# Altium schematic sheet 13-Experimental.SchDoc
size B; SheetNumber: 13; SheetTotal: 22
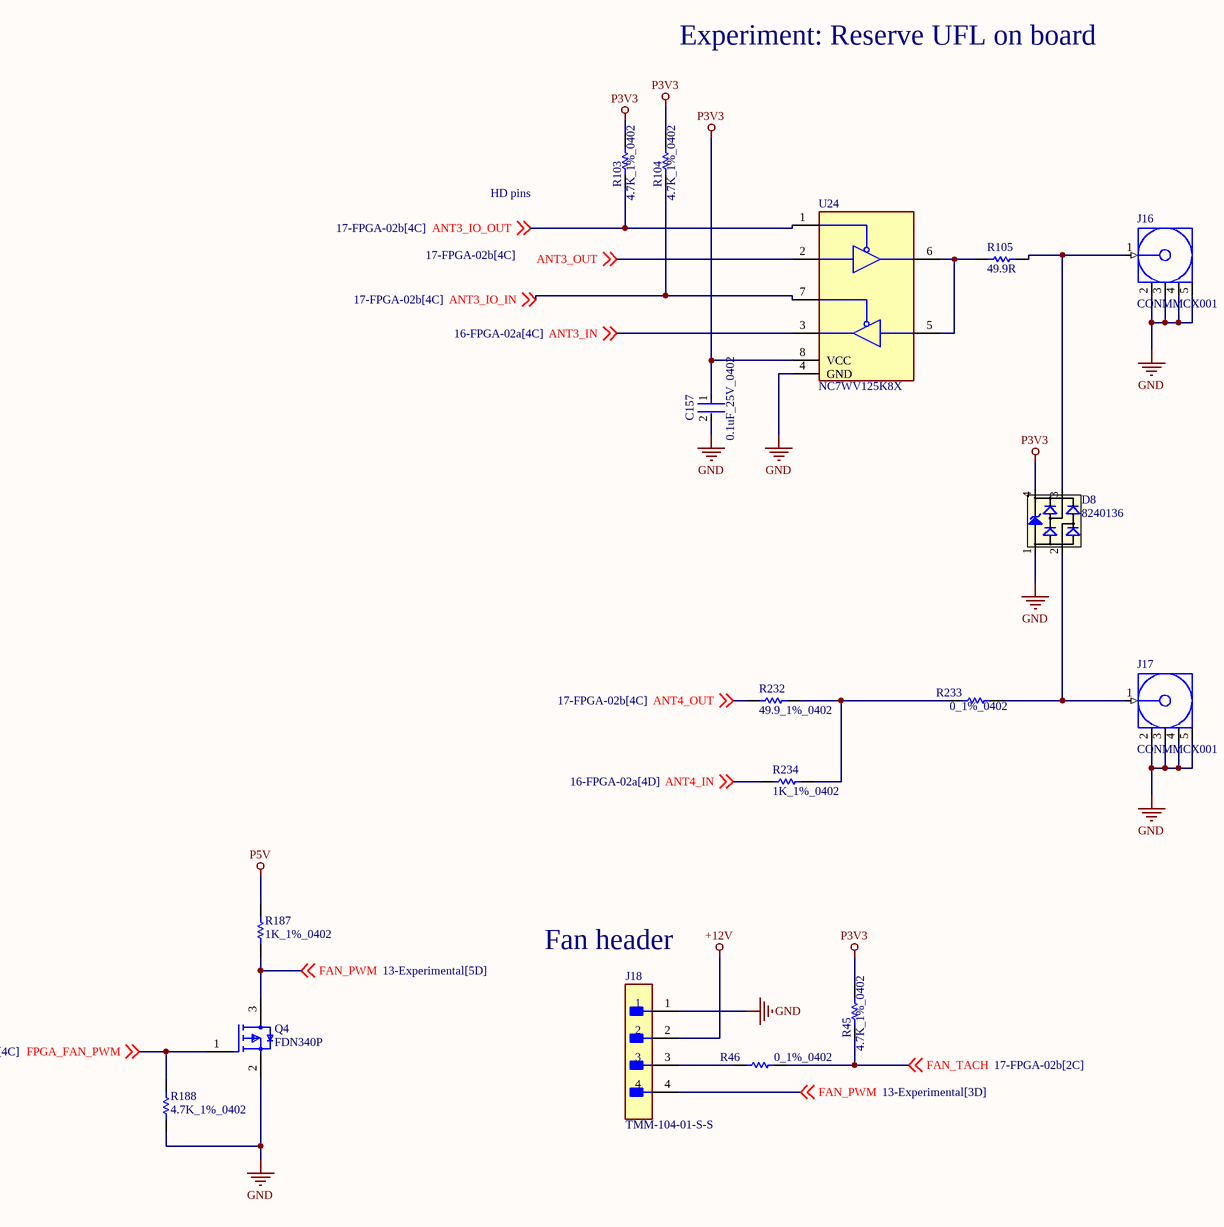
[diagram p0: 13-Experimental.SchDoc]

## Parts
C157  0.1uF_25V_0402  [FP-0402-L_1_0_1-W_0_5_0_1-IPC_C]
D8  8240136  [SOT143-4L]
J16  CONMMCX001  [CON-MMCX]
J17  CONMMCX001  [CON-MMCX]
J18  TMM-104-01-S-S  [FP-TMM-104-01-S-S-MFG]
Q4  FDN340P  [FP-527AG-MFG]
R45  4.7K_1%_0402  [RESC1005X40X25NL10T10]
R46  0_1%_0402  [RESC1005X40X25LL05T05]
R103  4.7K_1%_0402  [RESC1005X40X25NL10T10]
R104  4.7K_1%_0402  [RESC1005X40X25NL10T10]
R105  49.9R  [RESC1608X55X25NL10T15]
R187  1K_1%_0402  [RESC1005X40X25NL05T05]
R188  4.7K_1%_0402  [RESC1005X40X25NL10T10]
R232  49.9_1%_0402  [RESC1005X40X25NL10T10]
R233  0_1%_0402  [RESC1005X40X25LL05T05]
R234  1K_1%_0402  [RESC1005X40X25NL05T05]
U24  NC7WV125K8X  [SOP50P310X90-8N]

## Nets
+12V: J18.2
GND: C157.2 D8.1(GND) J16.2(GND) J16.3(GND) J16.4(GND) J16.5(GND) J17.2(GND) J17.3(GND) J17.4(GND) J17.5(GND) J18.1 Q4.2(S) R188.1 U24.4(GND)
P3V3: C157.1 D8.4(VDD) R45.1 R103.1 R104.1 U24.8(VCC)
P5V: R187.2
ANT3_IN: U24.3 ; off-sheet ANT3_IN
ANT3_IO_IN: R104.2 U24.7 ; off-sheet ANT3_IO_IN
ANT3_IO_OUT: R103.2 U24.1 ; off-sheet ANT3_IO_OUT
ANT3_OUT: U24.2 ; off-sheet ANT3_OUT
ANT4_IN: R234.1 ; off-sheet ANT4_IN
ANT4_OUT: R232.1 ; off-sheet ANT4_OUT
FAN_PWM: J18.4 Q4.3(D) R187.1 ; off-sheet FAN_PWM
FAN_TACH: R45.2 R46.2 ; off-sheet FAN_TACH
FPGA_FAN_PWM: Q4.1(G) R188.2 ; off-sheet FPGA_FAN_PWM
NetD8_2: D8.2(I/O1) J17.1(Signal) R233.2
NetD8_3: D8.3(I/O2) J16.1(Signal) R105.2
NetJ18_3: J18.3 R46.1
NetR105_1: R105.1 U24.5 U24.6
NetR232_2: R232.2 R233.1 R234.2

## Notes on the sheet
- Experiment: Reserve UFL on board
- HD pins
- Fan header

## Library data of the parts
C157 = CMP-2008-02519-2: General Purpose Ceramic Capacitor, 0402, 100nF, 10%, X7R, 15%, 25V; Package Quantity: 1; Capacitance: 100nF; Min Operating Temperature: -55°C; Voltage: 25V; Voltage Rating: 25V; Construction: Flat; Max Operating Temperature: 125°C; Radiation Hardening: No; Depth: 0.5mm; Thickness: 0.022inch; Voltage Rating (DC): 25V; Number of Pins: 2; Lead Free: Lead Free; Series: -; REACH SVHC: No SVHC; Length: 1mm; Dielectric: X7R; RoHS Compliant: Yes; Mount: Surface Mount; Packaging: Tape and Reel; Case/Package: 0402; Case Code (Imperial): 0402; Termination: SMD/SMT; Width: 0.02inch; Case Code (Metric): 1005; Tolerance: 10%
D8 = CMP-1486-00002-1: TVS Diode WE-TVS-HS, VRWM=3.3V; Manufacturer: Wuerth Elektronik; Reverse Stand Off Voltage: 3.3V; PartNumber: 8240136; ComponentLink1Description: Manufacturer URL; PackageReference: SOT143-4L; ComponentLink1URL: http://www.we-online.com; ComponentLink2Description: Datasheet; ComponentLink2URL: http://katalog.we-online.de/kataloge/eisos/media/pdf/8240136.pdf
J16 J17 = CMP-0168-00018-1: MMCX Female PCB Mount Connector, Thru-Hole; PCB_Layout: Pads complies with manufacturer's recommendation.; PackageReference: CON-MMCX; PackageDescription: MMCX Female PCB Mount Connector, Thru-Hole, 3.5 x 3.5 mm Body; DatasheetVersion: rev1.0, Jun-2006; PackageVersion: rev1.0, Jun-2006
J18 = CMP-02766-001674-1: CONN HEADER VERT 4POS 2MM; Max Current Rating: 3.9A; Connector Type: Male Pin; Max Voltage Rating (AC): 500V; Number of Contacts: 4; Gender: Male; Color: Black; Packaging: Bulk; Orientation: Straight; Contact Mating Length: 0.126inch; Contact Plating: Gold; Max Operating Temperature: 125°C; Housing Color: Black; Contact Material: Bronze; Package Quantity: 1; Housing Material: Polymer; Radiation Hardening: No; Pitch: 2mm; Contact Type: Male Pin; Number of Positions: 4; Number of Rows: 1; Lead Free: Lead Free; Width: 1.97mm; Termination: Solder; Depth: 1.97mm; Series: FleXYZ™ TMM; RoHS Compliant: Yes; Length: 8mm; Min Operating Temperature: -55°C; Mount: Through Hole
Q4 = CMP-2100-03638-2: MOSFET P-CH 20V 2A SSOT3; Fall Time: 11ns; Rise Time: 9ns; Voltage Rating (DC): -20V; Power Dissipation: 500mW; Nominal Vgs: -800mV; Current Rating: -2A; Gate to Source Voltage (Vgs): 8V; Rds On Max: 70mR; Turn-Off Delay Time: 27ns; Element Configuration: Single; Number of Elements: 1; Input Capacitance: 779pF; Drain to Source Resistance: 60mR; Turn-On Delay Time: 10ns; Package Quantity: 1; Mount: Surface Mount; Case/Package: SOT-23; Min Operating Temperature: -55°C; REACH SVHC: No SVHC; Weight: 0.03g; Packaging: Tape and Reel; Threshold Voltage: -800mV; Max Operating Temperature: 150°C; Dual Supply Voltage: -20V; Termination: SMD/SMT; Drain to Source Voltage (Vdss): 20V; Height: 0.94mm; Length: 2.92mm; Contact Plating: Tin; Width: 3.05mm; Drain to Source Breakdown Voltage: -20V; Max Power Dissipation: 500mW; Continuous Drain Current (ID): 2A; Number of Pins: 3; Lead Free: Lead Free; Radiation Hardening: No; On-State Resistance: 70MR
R45 R103 R104 R188 = CMP-2002-05217-1: Manufacturer: Bourns; Part Number: CR0402-FX-4701GLF
R46 R233 = CMP-2000-07451-1: Chip Resistor, 0 Ohm, 0.1 W, -55 to 155 degC, 0402 (1005 Metric), RoHS, Tape and Reel; Manufacturer: Panasonic; Voltage Rating (DC): 50V; Temperature Coefficient: 600ppm/��C; Max Power Dissipation: 100mW; Resistance: 0mOhm; Tolerance: 5%; Number of Terminations: 2; Mount: SurfaceMount; Height: 0.35mm; Packaging: TapeandReel; Contact Plating: Tin; Manufacturer URL: http://www.panasonic.com/; Composition: ThickFilm; Max Operating Temperature: 155degC; REACH SVHC: NoSVHC; Case/Package: 0402; Package Reference: 402; Depth: 0.5mm; Package Description: 2-Pin Surface Mount Device, Body 1 x 0.5 mm; Datasheet URL: https://industrial.panasonic.com/cdbs/www-data/pdf/RDA0000/AOA0000C301.pdf; RoHSCompliant: True; Case Code (Imperial): 0402; Military Standard: Not; Min Operating Temperature: -55degC; Power Rating: 100mW; Datasheet Version: 03/2015; Length: 1mm; Case Code (Metric): 1005; Termination: SMD/SMT; Mounting Technology: SurfaceMount; Voltage Rating: 50V; Width: 0.02inch; Package Quantity: 1; Lead Free: LeadFree; Radiation Hardening: No
R105 = CMP-1659-00036-1: General Purpose Chip Resistor, 49.9 Ohm, +/- 1%, -55 to 155 degC, 0603 (1608 Metric), RoHS, Tape and Reel; Max Supply Voltage: 3.63 V; Case\Package: LQFP; Interface: SPI; Min Supply Voltage: 2.97 V; PackageReference: 0603; Packaging: Tray; ComponentLink2Description: Datasheet; ComponentLink1Description: Manufacturer URL; ComponentLink2URL: https://datasheet.ciiva.com/11808/0900766b80f96399-11808223.pdf; RoHSCompliant: true; Max Operating Temperature: 85 degC; ComponentLink1URL: http://www.yageo.com/; PackageDescription: 2-Pin Surface Mount Device, Body 1.6 x 0.8 mm; DatasheetVersion: Rev. 4, 04/2009; Min Operating Temperature: -40 degC; Package Quantity: 250; Pins: 48
R187 R234 = CMP-2002-08277-1: Manufacturer: Vishay Dale; Part Number: CRCW04021K00FKTD
R232 = CMP-2002-04448-1: Part Number: RK73H1ETTP49R9F; Manufacturer: KOA Speer
U24 = NC7WV125K8X: Integrated Circuit; Manufacturer_Name: ON Semiconductor; Datasheet Link: https://www.mouser.com/datasheet/2/308/NC7WV125-1301459.pdf; Height: 0.9mm; Manufacturer_Part_Number: NC7WV125K8X; Mouser Part Number: 512-NC7WV125K8X; Mouser Price/Stock: https://www.mouser.com/Search/Refine.aspx?Keyword=512-NC7WV125K8X; Arrow Part Number: NC7WV125K8X; Arrow Price/Stock: https://www.arrow.com/en/products/nc7wv125k8x/on-semiconductor